# EAGLE design probe_circuit (EAGLE 7.2.0)
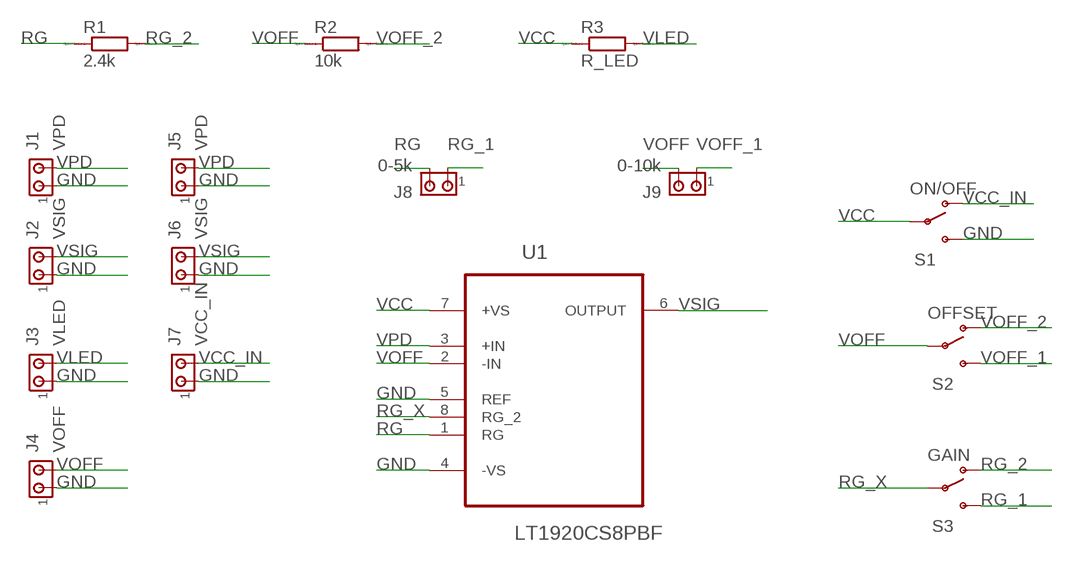
[diagram p0: schematic, sheet 1]

## Parts
J1  VPD  MTA02-100  [10X02MTA]
J2  VSIG  MTA02-100  [10X02MTA]
J3  VLED  MTA02-100  [10X02MTA]
J4  VOFF  MTA02-100  [10X02MTA]
J5  VPD  MTA02-100  [10X02MTA]
J6  VSIG  MTA02-100  [10X02MTA]
J7  VCC_IN  MTA02-100  [10X02MTA]
J8  0-5k  MTA02-100  [10X02MTA]
J9  0-10k  MTA02-100  [10X02MTA]
R1  2.4k  R0204/7  [0204/7]
R2  10k  R0204/7  [0204/7]
R3  R_LED  R0204/7  [0204/7]
S1  ON/OFF  SWITCH-SPDTPTH  [SWITCH-SPDT]
S2  OFFSET  SWITCH-SPDTPTH  [SWITCH-SPDT]
S3  GAIN  SWITCH-SPDTPTH  [SWITCH-SPDT]
U1  LT1920CS8PBF  [SOIC127P600X175-8N]

## Nets
GND: J1.1 J2.1 J3.1 J4.1 J5.1 J6.1 J7.1 S1.3(S) U1.4(-VS) U1.5(REF)
RG: J8.2 R1.1 U1.1(RG)
RG_1: J8.1 S3.3(S)
RG_2: R1.2 S3.1(O)
RG_X: S3.2(P) U1.8(RG_2)
VCC: R3.1 S1.2(P) U1.7(+VS)
VCC_IN: J7.2 S1.1(O)
VLED: J3.2 R3.2
VOFF: J4.2 J9.2 R2.1 S2.2(P) U1.2(-IN)
VOFF_1: J9.1 S2.3(S)
VOFF_2: R2.2 S2.1(O)
VPD: J1.2 J5.2 U1.3(+IN)
VSIG: J2.2 J6.2 U1.6(OUTPUT)

## Library data of the parts
J1-J9 = con-amp:MTA02-100: AMP connector
R1-R3 = eagle-ltspice:R: RESISTOR, European symbol; SPICEMODEL: NONE; SPICEPREFIX: R
S1-S3 = SparkFun-Electromechanical:SWITCH-SPDT: SPDT Switch Simple slide switch, Spark Fun Electronics SKU : COM-00102 DPDT SMT slide switch, AYZ0202, SWCH-08179; PROD_ID: SWCH-08261
U1 = LTC_By_element14_Batch_1:LT1920CS8PBF: Single Resistor Gain Programmable, Precision Instrumentation Amplifier; MPN: LT1920CS8#PBF; OC_FARNELL: 1663517; OC_NEWARK: 57M7142; PACKAGE: SOIC-8; SUPPLIER: Linear Technology

## Board
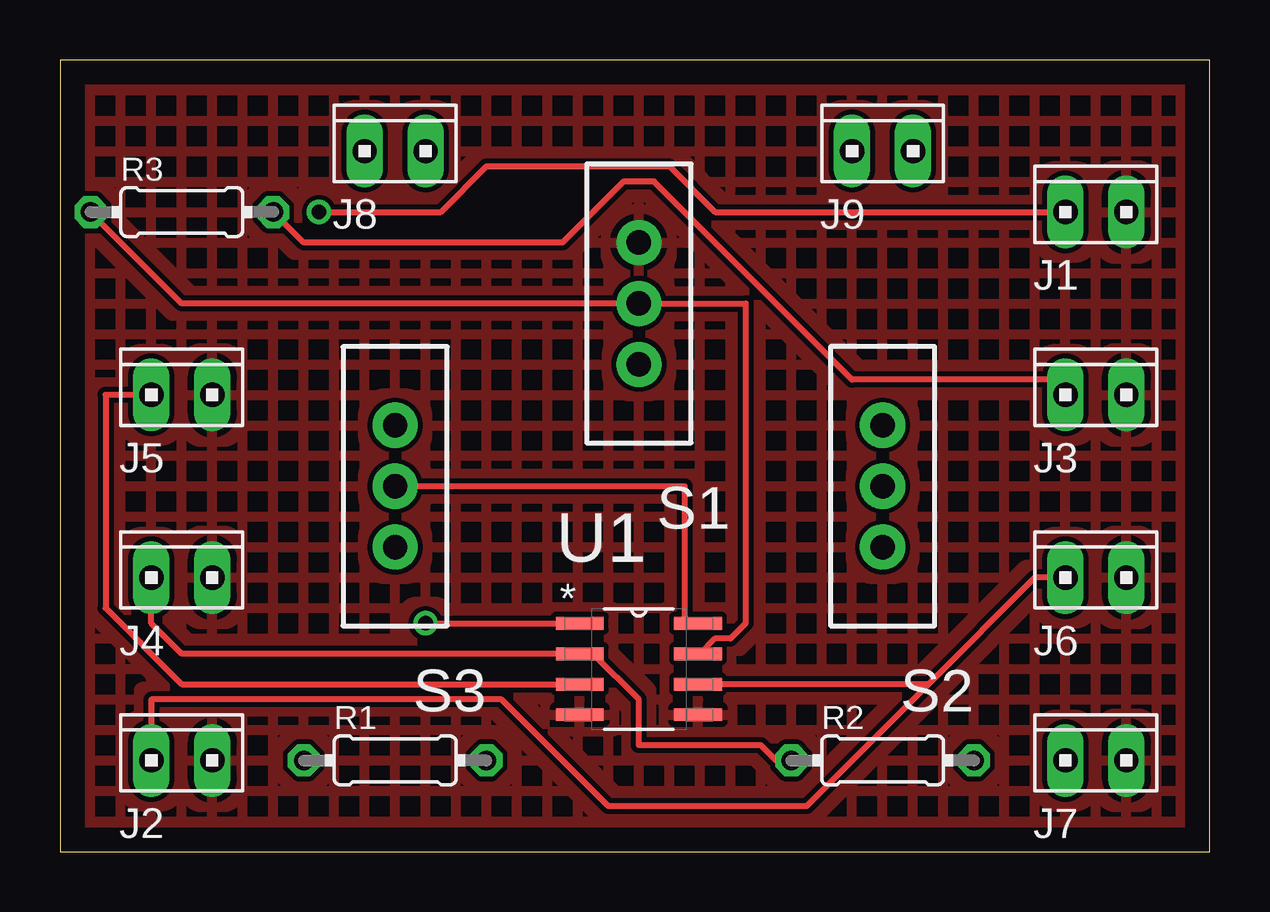
[diagram p1: board, top side]
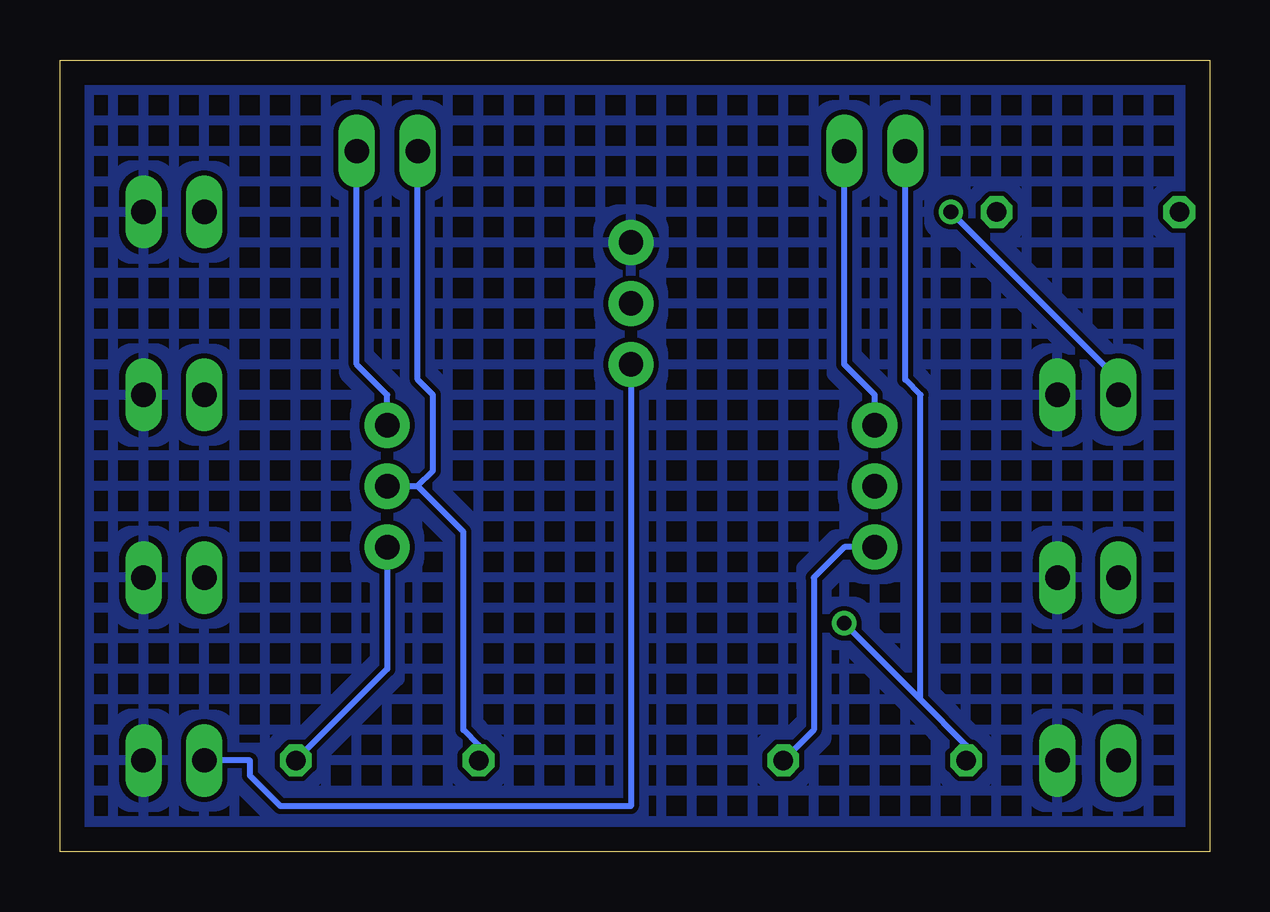
[diagram p2: board, bottom side, seen from below]

Size 47.93 x 33.01 mm. Coordinates in mm from the lower left corner, seen from the top.
Outline: 0,0 47.93,0 47.93,33.01 0,33.01 0,0
Copper layers (1*16): Top 0.035mm / dielectric 1.5mm / Bottom 0.035mm
Design rules "default": minimum track width 10mil, minimum drill 24mil, track to track 8mil, track to pad 8mil, pad to pad 8mil, via to via 8mil, smd to smd 8mil, copper to edge 40mil, drill to drill 8mil, minimum pad ring 10mil, minimum via ring 8mil, stop-mask expansion 4mil, vias tented up to drill 0mil, thermal gap 10mil

### Footprints (pad centres in the part's own frame; a part is rotated, then mirrored left to right if it is on the bottom)
10X02MTA = drill 1.016 long: 1 1.27,0; 2 -1.27,0
0204/7 = drill 0.813 octagon: 1 -3.81,0; 2 3.81,0
SWITCH-SPDT = drill 1.016 pad 1.88: 1 0,2.54; 2 0,0; 3 0,-2.54
SOIC127P600X175-8N = smd 1.981 x 0.533: 1 -2.464,1.905; 2 -2.464,0.635; 3 -2.464,-0.635; 4 -2.464,-1.905; 5 2.464,-1.905; 6 2.464,-0.635; 7 2.464,0.635; 8 2.464,1.905

### Placement (x,y rotation side)
J1  43.18,26.67 0 top
J2  5.08,3.81 0 top
J3  43.18,19.05 0 top
J4  5.08,11.43 0 top
J5  5.08,19.05 0 top
J6  43.18,11.43 0 top
J7  43.18,3.81 0 top
J8  13.97,29.21 0 top
J9  34.29,29.21 0 top
R1  13.97,3.81 0 top
R2  34.29,3.81 0 top
R3  5.08,26.67 0 top
S1  24.13,22.86 180 top
S2  34.29,15.24 180 top
S3  13.97,15.24 180 top
U1  24.13,7.62 0 top

### Tracks (layer width: path | path; a pad name or v marks a point on that pad's centre or on a via)
GND
  pour Bottom (hatched): -3.81,34.29 52.07,34.29 52.07,-1.27 -3.81,-1.27
  pour Top (hatched): -1.27,36.83 49.53,36.83 49.53,-3.81 -1.27,-3.81
RG  (via drill 0.61)
  Top 0.254: v15.24,9.53 U1.1
  Bottom 0.254: 12.06,6.35 10.16,4.45 R1.1 | 12.06,6.35 v15.24,9.53 | J8.2 12.7,19.68 12.06,19.05 12.06,6.35
RG_1
  Bottom 0.254: J8.1 15.24,20.32 13.97,19.05 S3.3
RG_2
  Bottom 0.254: R1.2 16.51,5.08 16.51,11.43 15.24,12.7 S3.1
RG_X
  Top 0.254: S3.2 26.04,15.24 26.04,9.53 U1.8
VCC
  Top 0.254: U1.7 26.67,8.26 27.3,8.89 27.94,8.89 28.57,9.53 28.57,22.86 S1.2 5.08,22.86 R3.1
VCC_IN
  Bottom 0.254: J7.2 40.01,3.81 40.01,3.17 38.73,1.91 24.13,1.91 S1.1
VLED
  Top 0.254: R3.2 10.16,25.4 20.95,25.4 23.5,27.94 24.77,27.94 33.02,19.68 41.27,19.68 J3.2
VOFF
  Top 0.254: R2.1 29.84,3.81 29.21,4.45 24.13,4.45 24.13,6.35 22.23,8.26 U1.2 5.08,8.26 3.81,9.53 J4.2
  Bottom 0.254: J9.2 33.02,19.68 32.38,19.05 32.38,15.88 33.02,15.24 | S2.2 33.02,15.24 | 33.02,15.24 31.11,13.34 31.11,5.08 30.48,4.45 R2.1
VOFF_1
  Bottom 0.254: J9.1 35.56,20.32 34.29,19.05 S2.3
VOFF_2
  Bottom 0.254: R2.2 34.29,7.62 S2.1
VPD  (via drill 0.61)
  Top 0.254: U1.3 5.08,6.99 1.91,10.16 1.91,19.05 J5.2 | J1.2 27.3,26.67 25.4,28.57 17.78,28.57 15.88,26.67 v10.79,26.67
  Bottom 0.254: v10.79,26.67 3.81,19.68 J5.2
VSIG
  Top 0.254: 36.2,6.99 U1.6 | 36.2,6.99 40.64,11.43 J6.2 | J2.2 3.81,6.35 18.41,6.35 22.86,1.91 31.11,1.91 36.2,6.99